# Altium schematic sheet I2Cpad.SchDoc
size Letter; Author: FF7 HD Remastered
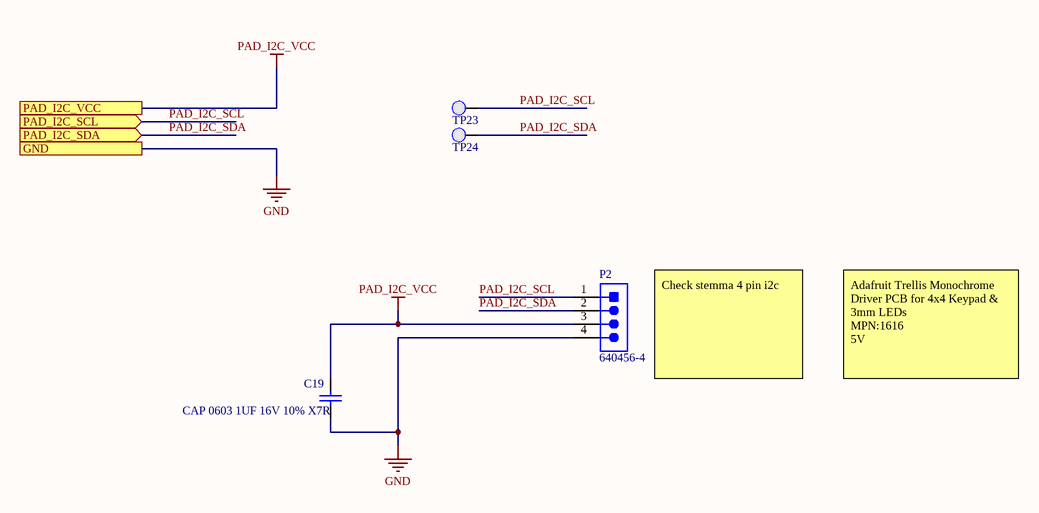
[diagram p0: I2Cpad.SchDoc]

## Parts
C19  CAP 0603 1UF 16V 10% X7R  [0603_CAP]
P2  640456-4  [TECO-640456-4]
TP23  Test Point 0.1"  [Test Point 0.1"-Footprint-1]  (value not drawn)  (no BOM)
TP24  Test Point 0.1"  [Test Point 0.1"-Footprint-1]  (value not drawn)  (no BOM)

## Ports
GND, PAD_I2C_SCL (in), PAD_I2C_SDA (in), PAD_I2C_VCC

## Nets
GND: C19.1 P2.4 ; port GND
PAD_I2C_VCC: C19.2 P2.3 ; port PAD_I2C_VCC
PAD_I2C_SCL: P2.1 TP23.1(PAD) ; port PAD_I2C_SCL
PAD_I2C_SDA: P2.2 TP24.1(PAD) ; port PAD_I2C_SDA

## Notes on the sheet
- Check stemma 4 pin i2c
- Adafruit Trellis Monochrome Driver PCB for 4x4 Keypad & 3mm LEDs
  MPN:1616
  5V
- Title:
- Desc:
- Size:
- Letter
- Auth:
- Proj:
- Sheet
- of
- www.seas.upenn.edu
- Electrical and Systems Engineering

## Library data of the parts
C19 = CMP-011-000286-1: Capacitor Surface Mount 0603 Footprint 1UF 16V 10% Tolerance Ceramic X7R; Manufacturer: Various; PCB Package: 0603; Description in Visual: Cap SMT 0603 1UF 16V 10% Ceramic X7R; P/N: CAP 0603 1UF 16V 10% X7R; Manufacturer P/N: CAP 0603 1UF 16V 10% X7R; Type: Ceramic X7R; Mount: SMT
P2 = CMP-2000-05419-1: Male Header, Pitch 2.54 mm, 1 x 4 Position, Height 10.03 mm, Tail Length 3.56 mm, RoHS, Bulk; Manufacturer: TE Connectivity; Material, Housing: Polyester; Primary Type: InterconnectSystem; Mount Angle: Vertical; Color, Housing: White; Current, Rating: 5 / A; Agency Approvals: CSA,UL; Contact Termination Area Plating: Tin; Temperature, Operating: -55to+105 / degC; Standards: RoHSCompliant,ELVCompliant,UL94V-0; Number of Positions: 4; Brand/Series: MTA-100Series; Angle: Straight; Pin Spacing: 0.1 / "; Material, Contact: CopperAlloy; Connector Type: MTA-100; Special Features: Pinstrip; Mounting Hole Size: 0.04 / "; Contact Centerline Spacing: 0.100 / in.; Voltage, Rating: 250 / V; Manufacturer URL: http://www.te.com/; Length, Pin: 0.14 / "; Length, Overall: 0.4 / "; Color: White; Flammability Rating: UL94V-0; Mounting Type: PCMount; Termination: Solder; Datasheet URL: https://datasheet.ciiva.com/16286/eng-ds-82056-mta-0608-16286228.pdf; Number of Contacts: 4; Contact Shape: Square; Contact Mating Area Plating: Tin; Length, Terminal Post: 0.14 / in.; Size, Post: 0.025 / in.; Contact Plating: Tin; Type: PCBPlug; Datasheet Version: Dec-14; Number of Rows: 1
TP23 TP24 = CMP-00086-1